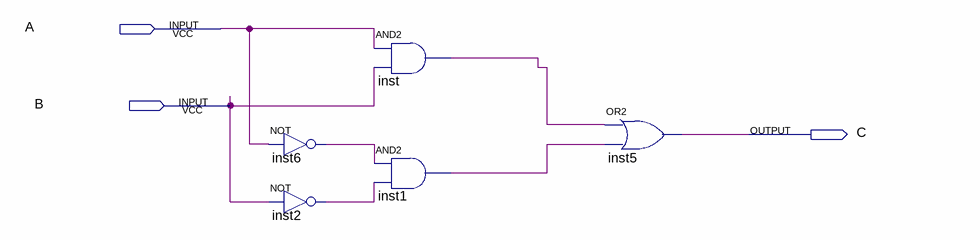
[diagram p0: schematic sheet]
// Quartus schematic xnor_gate.bdf as structural Verilog: 5 symbols, 3 pins
module xnor_gate (
  input  A,
  input  B,
  output C
);

  wire inst1_out, inst2_out, inst6_out, inst_out;

  not inst6 (inst6_out, A);
  not inst2 (inst2_out, B);
  and inst (inst_out, A, B);
  and inst1 (inst1_out, inst6_out, inst2_out);
  or inst5 (C, inst_out, inst1_out);
endmodule
